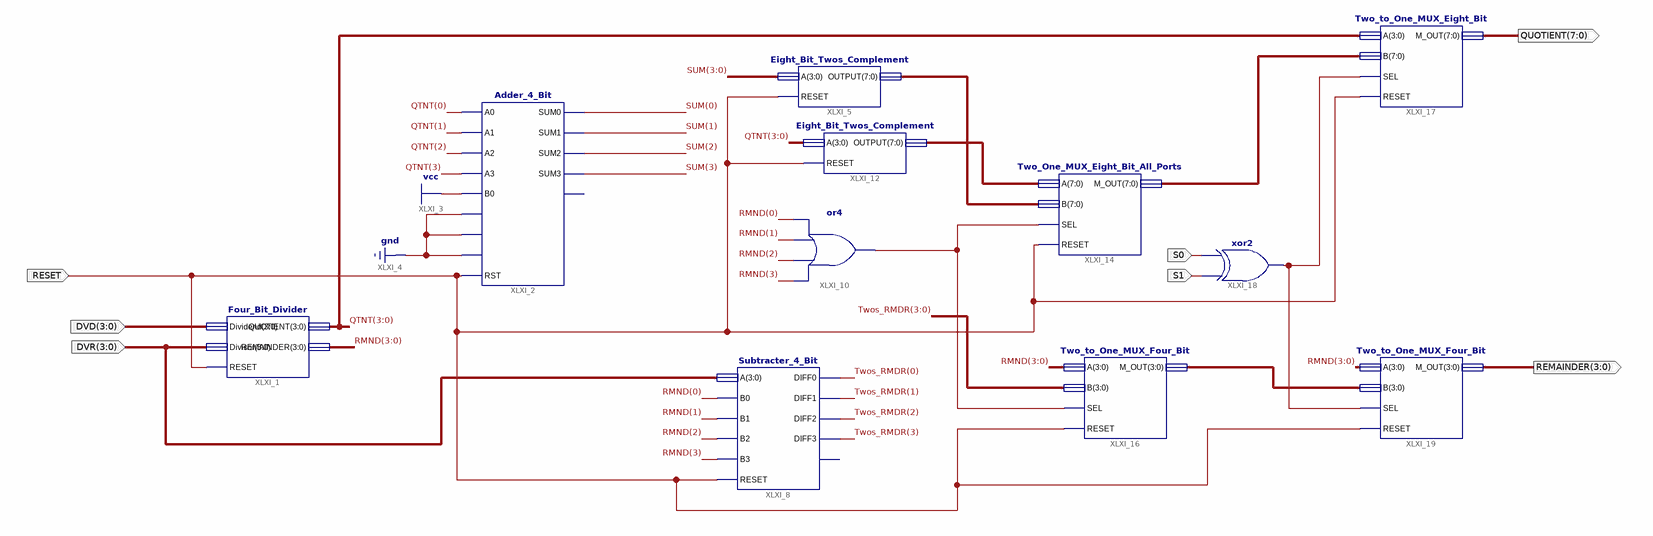
[diagram p0: schematic sheet 1]
// Xilinx ISE schematic Divider_Calculator.sch (spartan6) as structural Verilog: 11 symbols, 7 ports
module Divider_Calculator (
  input  [3:0] DVD,
  input  [3:0] DVR,
  input  S1,
  input  S0,
  input  RESET,
  output [7:0] QUOTIENT,
  output [3:0] REMAINDER
);

  wire XLXN_77, XLXN_105;
  wire [3:0] QTNT, RMND, SUM, Twos_RMDR, XLXN_92;
  wire [7:0] XLXN_78, XLXN_79, XLXN_88;

  Four_Bit_Divider XLXI_1 (.Dividend(DVD), .Divisor(DVR), .QUOTIENT(QTNT), .REMAINDER(RMND), .RESET(RESET));
  Adder_4_Bit XLXI_2 (
    .A0(QTNT[0]), .A1(QTNT[1]), .A2(QTNT[2]), .A3(QTNT[3]), .B0(1'b1), .B1(1'b0), .B2(1'b0), .B3(1'b0),
    .RST(RESET), .SUM0(SUM[0]), .SUM1(SUM[1]), .SUM2(SUM[2]), .SUM3(SUM[3]));  // open: SUM4
  Eight_Bit_Twos_Complement XLXI_5 (.A(SUM), .OUTPUT(XLXN_79), .RESET(RESET));
  Subtracter_4_Bit XLXI_8 (
    .A(DVR), .B0(RMND[0]), .B1(RMND[1]), .B2(RMND[2]), .B3(RMND[3]), .DIFF0(Twos_RMDR[0]),
    .DIFF1(Twos_RMDR[1]), .DIFF2(Twos_RMDR[2]), .DIFF3(Twos_RMDR[3]), .RESET(RESET));  // open: DIFF4
  or XLXI_10 (XLXN_77, RMND[3], RMND[2], RMND[1], RMND[0]);
  Eight_Bit_Twos_Complement XLXI_12 (.A(QTNT), .OUTPUT(XLXN_78), .RESET(RESET));
  Two_One_MUX_Eight_Bit_All_Ports XLXI_14 (.A(XLXN_78), .B(XLXN_79), .M_OUT(XLXN_88), .RESET(RESET), .SEL(XLXN_77));
  Two_to_One_MUX_Four_Bit XLXI_16 (.A(RMND), .B(Twos_RMDR), .M_OUT(XLXN_92), .RESET(RESET), .SEL(XLXN_77));
  Two_to_One_MUX_Eight_Bit XLXI_17 (.A(QTNT), .B(XLXN_88), .M_OUT(QUOTIENT), .RESET(RESET), .SEL(XLXN_105));
  xor XLXI_18 (XLXN_105, S1, S0);
  Two_to_One_MUX_Four_Bit XLXI_19 (.A(RMND), .B(XLXN_92), .M_OUT(REMAINDER), .RESET(RESET), .SEL(XLXN_105));
endmodule
